# Altium schematic sheet Sheet1.SchDoc
size A
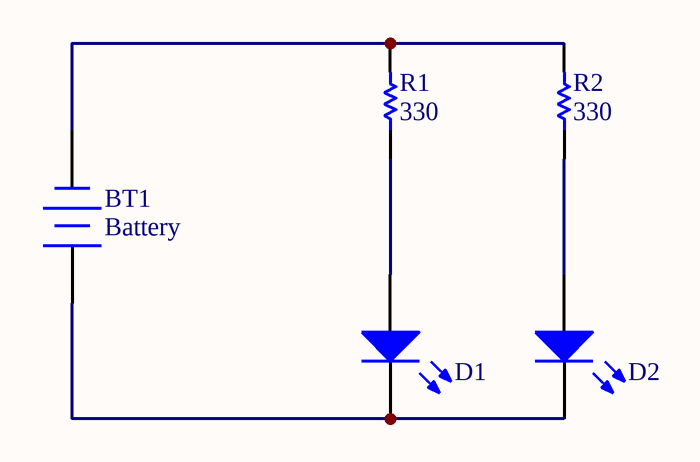
[diagram p0: Sheet1.SchDoc]

## Parts
BT1  Battery  [BAT-2]
D1  LED 3mm  [LED-3mm]  (value not drawn)
D2  LED 3mm  [LED-3mm]  (value not drawn)
R1  value 330  [Res50]  (hidden comment: Resistor vertical)
R2  value 330  [Res50]  (hidden comment: Resistor vertical)

## Nets
NetBT1_1: BT1.1(+) D1.2(K) D2.2(K)
NetBT1_2: BT1.2(-) R1.2 R2.2
NetD1_1: D1.1(A) R1.1
NetD2_1: D2.1(A) R2.1

## Library data of the parts
BT1 = Battery: Multicell Battery; Published: 24-Mar-1999; LatestRevisionDate: 17-Jul-2002; LatestRevisionNote: Re-released for DXP Platform.; PackageReference: BAT-2; Publisher: Altium Limited; PackageDescription: Battery; 2 Leads
D1 D2 = LED 3mm: Typical LED; Designer: Seyed Mohsen Ghasemian; Published: 02/04/2012; PackageReference: LED; Publisher: www.picpars.com; PackageDescription: LED; 2 Leads
R1 R2 = Resistor vertical: Resistor 0.5; Publisher: Seyed mohsen ghasemian; WEB: www.picpars.com